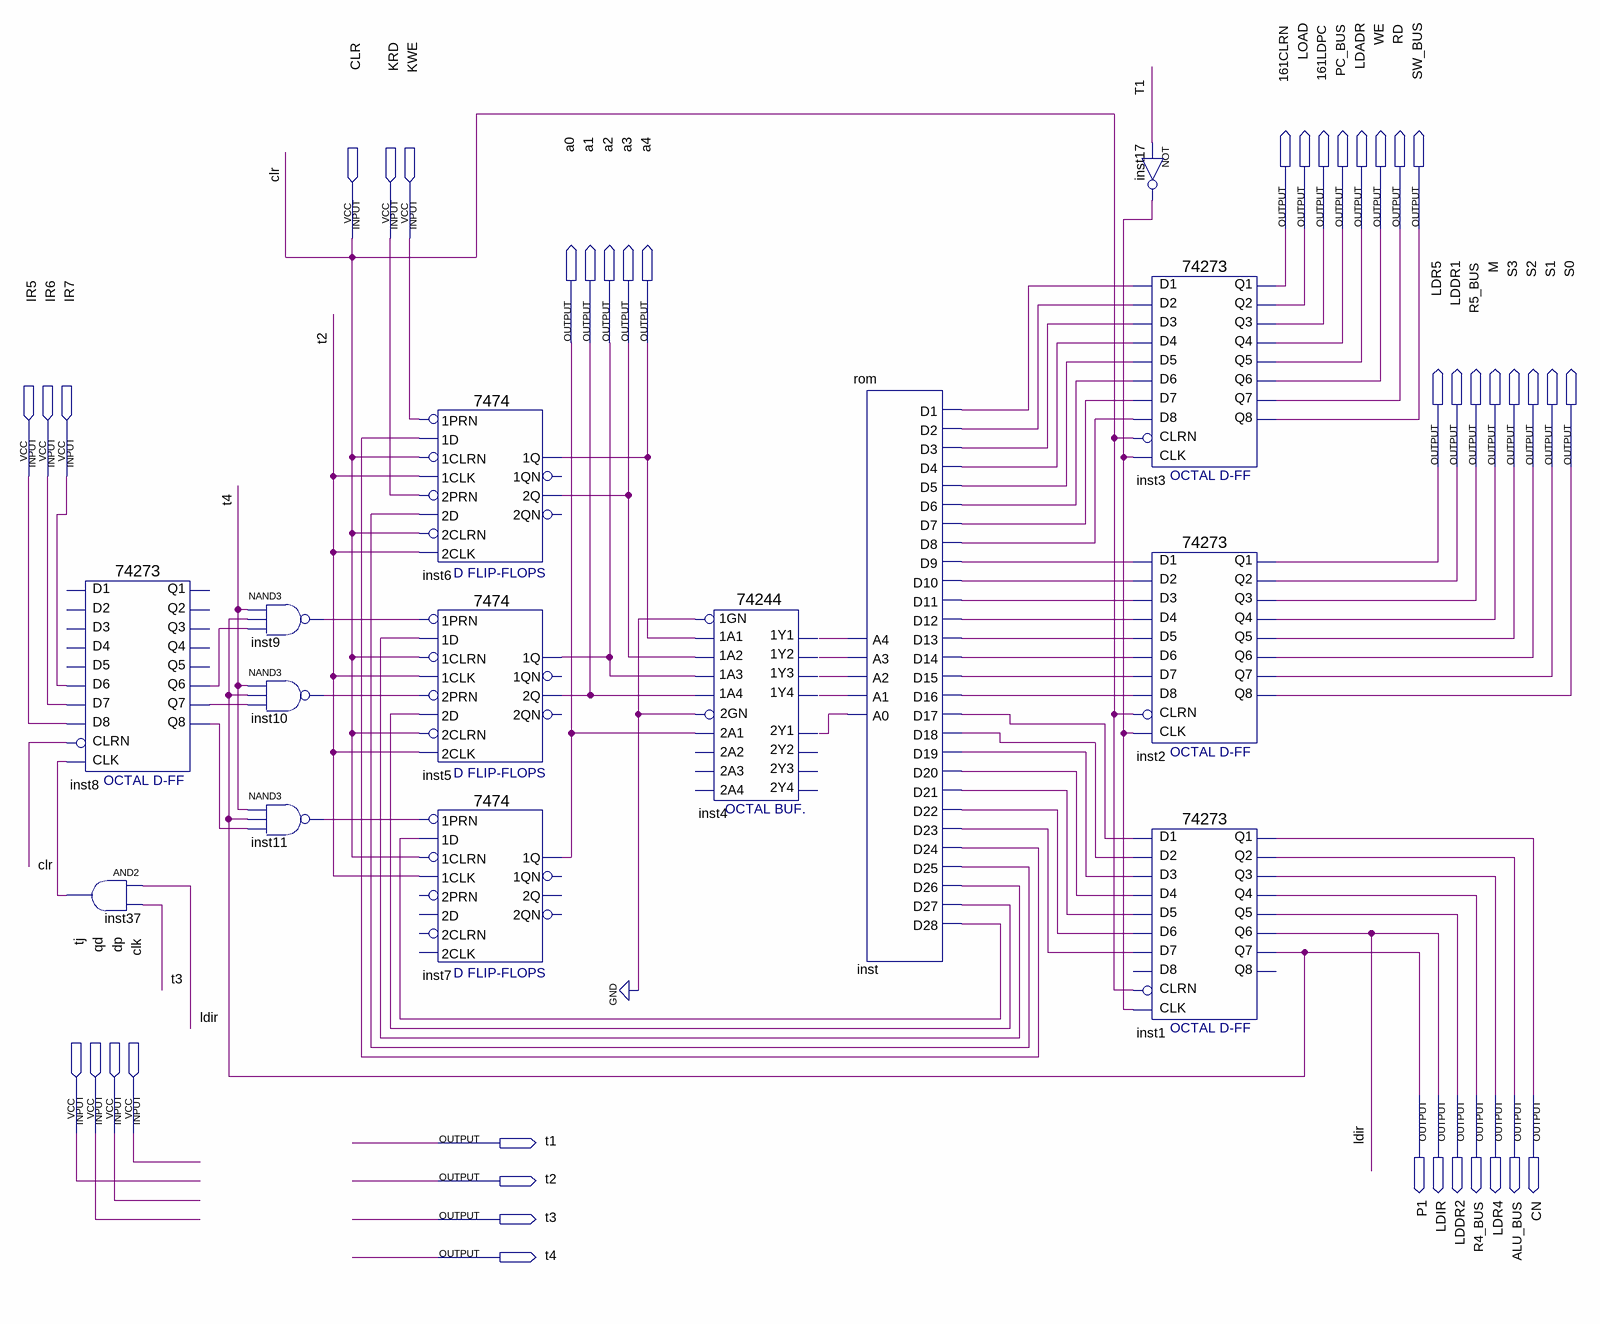
[diagram p0: schematic sheet]
// Quartus schematic micro_control.bdf as structural Verilog: 14 symbols, 42 pins
module micro_control (
  input  CLR,
  input  KRD,
  input  KWE,
  input  IR5,
  input  IR6,
  input  IR7,
  input  tj,
  input  qd,
  input  dp,
  input  clk,
  output \161CLRN ,
  output LOAD,
  output \161LDPC ,
  output PC_BUS,
  output LDADR,
  output WE,
  output RD,
  output SW_BUS,
  output a0,
  output a1,
  output a2,
  output a3,
  output a4,
  output LDR5,
  output LDDR1,
  output R5_BUS,
  output M,
  output S3,
  output S2,
  output S1,
  output S0,
  output P1,
  output LDIR,
  output LDDR2,
  output R4_BUS,
  output LDR4,
  output ALU_BUS,
  output CN,
  output t1,
  output t2,
  output t3,
  output t4
);

  wire inst4_1y1, inst4_1y2, inst4_1y3, inst4_1y4, inst4_2y1, inst8_q6, inst8_q7, inst8_q8, inst9_out,
       inst10_out, inst11_out, inst17_out, inst37_out, inst_d1, inst_d2, inst_d3, inst_d4, inst_d5, inst_d6,
       inst_d7, inst_d8, inst_d9, inst_d10, inst_d11, inst_d12, inst_d13, inst_d14, inst_d15, inst_d16,
       inst_d17, inst_d18, inst_d19, inst_d20, inst_d21, inst_d22, inst_d23, inst_d24, inst_d25, inst_d26,
       inst_d27, inst_d28;

  \74273  inst8 (
    .D7(IR6), .D6(IR7), .D8(IR5), .CLK(inst37_out), .CLRN(CLR), .Q6(inst8_q6), .Q7(inst8_q7), .Q8(inst8_q8));  // open: D2, D3, D1, D4, D5, Q4, Q1, Q2, Q3, Q5
  and inst37 (inst37_out, LDIR, t3);
  nand inst9 (inst9_out, t4, P1, inst8_q6);
  nand inst10 (inst10_out, t4, P1, inst8_q7);
  nand inst11 (inst11_out, t4, P1, inst8_q8);
  \7474  inst6 (
    .\2D (inst_d25), .\2PRN (KRD), .\1CLK (t2), .\1D (inst_d24), .\1PRN (KWE), .\2CLK (t2), .\2CLRN (CLR),
    .\1CLRN (CLR), .\2Q (a3), .\1Q (a4));  // open: 1QN, 2QN
  \7474  inst5 (
    .\2D (inst_d27), .\2PRN (inst10_out), .\1CLK (t2), .\1D (inst_d26), .\1PRN (inst9_out), .\2CLK (t2),
    .\2CLRN (CLR), .\1CLRN (CLR), .\2Q (a1), .\1Q (a2));  // open: 1QN, 2QN
  \7474  inst7 (
    .\1CLK (t2), .\1D (inst_d28), .\1PRN (inst11_out), .\1CLRN (CLR), .\1Q (a0));  // open: 2D, 2PRN, 2CLK, 2CLRN, 1QN, 2Q, 2QN
  \74244  inst4 (
    .\1A2 (a3), .\1A4 (a1), .\1A1 (a4), .\1A3 (a2), .\1GN (1'b0), .\2GN (1'b0), .\2A1 (a0),
    .\1Y2 (inst4_1y2), .\1Y4 (inst4_1y4), .\2Y1 (inst4_2y1), .\1Y1 (inst4_1y1), .\1Y3 (inst4_1y3));  // open: 2A3, 2A4, 2A2, 2Y3, 2Y4, 2Y2
  rom inst (
    .A4(inst4_1y1), .A3(inst4_1y2), .A2(inst4_1y3), .A1(inst4_1y4), .A0(inst4_2y1), .D1(inst_d1),
    .D2(inst_d2), .D3(inst_d3), .D4(inst_d4), .D5(inst_d5), .D6(inst_d6), .D7(inst_d7), .D8(inst_d8),
    .D9(inst_d9), .D10(inst_d10), .D11(inst_d11), .D12(inst_d12), .D13(inst_d13), .D14(inst_d14),
    .D15(inst_d15), .D16(inst_d16), .D17(inst_d17), .D18(inst_d18), .D19(inst_d19), .D20(inst_d20),
    .D21(inst_d21), .D22(inst_d22), .D23(inst_d23), .D24(inst_d24), .D25(inst_d25), .D26(inst_d26),
    .D27(inst_d27), .D28(inst_d28));
  not inst17 (inst17_out, t1);
  \74273  inst3 (
    .D2(inst_d2), .D3(inst_d3), .D1(inst_d1), .D4(inst_d4), .D7(inst_d7), .D6(inst_d6), .D5(inst_d5),
    .D8(inst_d8), .CLK(inst17_out), .CLRN(CLR), .Q4(PC_BUS), .Q1(\161CLRN ), .Q2(LOAD), .Q3(\161LDPC ),
    .Q6(WE), .Q5(LDADR), .Q7(RD), .Q8(SW_BUS));
  \74273  inst2 (
    .D2(inst_d10), .D3(inst_d11), .D1(inst_d9), .D4(inst_d12), .D7(inst_d15), .D6(inst_d14), .D5(inst_d13),
    .D8(inst_d16), .CLK(inst17_out), .CLRN(CLR), .Q4(M), .Q1(LDR5), .Q2(LDDR1), .Q3(R5_BUS), .Q6(S2),
    .Q5(S3), .Q7(S1), .Q8(S0));
  \74273  inst1 (
    .D2(inst_d18), .D3(inst_d19), .D1(inst_d17), .D4(inst_d20), .D7(inst_d23), .D6(inst_d22), .D5(inst_d21),
    .CLK(inst17_out), .CLRN(CLR), .Q4(R4_BUS), .Q1(CN), .Q2(ALU_BUS), .Q3(LDR4), .Q6(LDIR), .Q5(LDDR2),
    .Q7(P1));  // open: D8, Q8
endmodule
